# Altium schematic sheet Control Board.SchDoc
size 431 x 279 mm; SheetNumber: 1; SheetTotal: 2; SPICEModelCacheDHLYHQXB: <root> / <DocumentId>DHLYHQXB</DocumentId> / <CacheFrame Number="0"> / <Model Name="cap" Kind="MDL"> / <Text>*Default semiconductor capacitor / .MODEL CAP C()</Text> / </Model> / </CacheFrame> / </root>
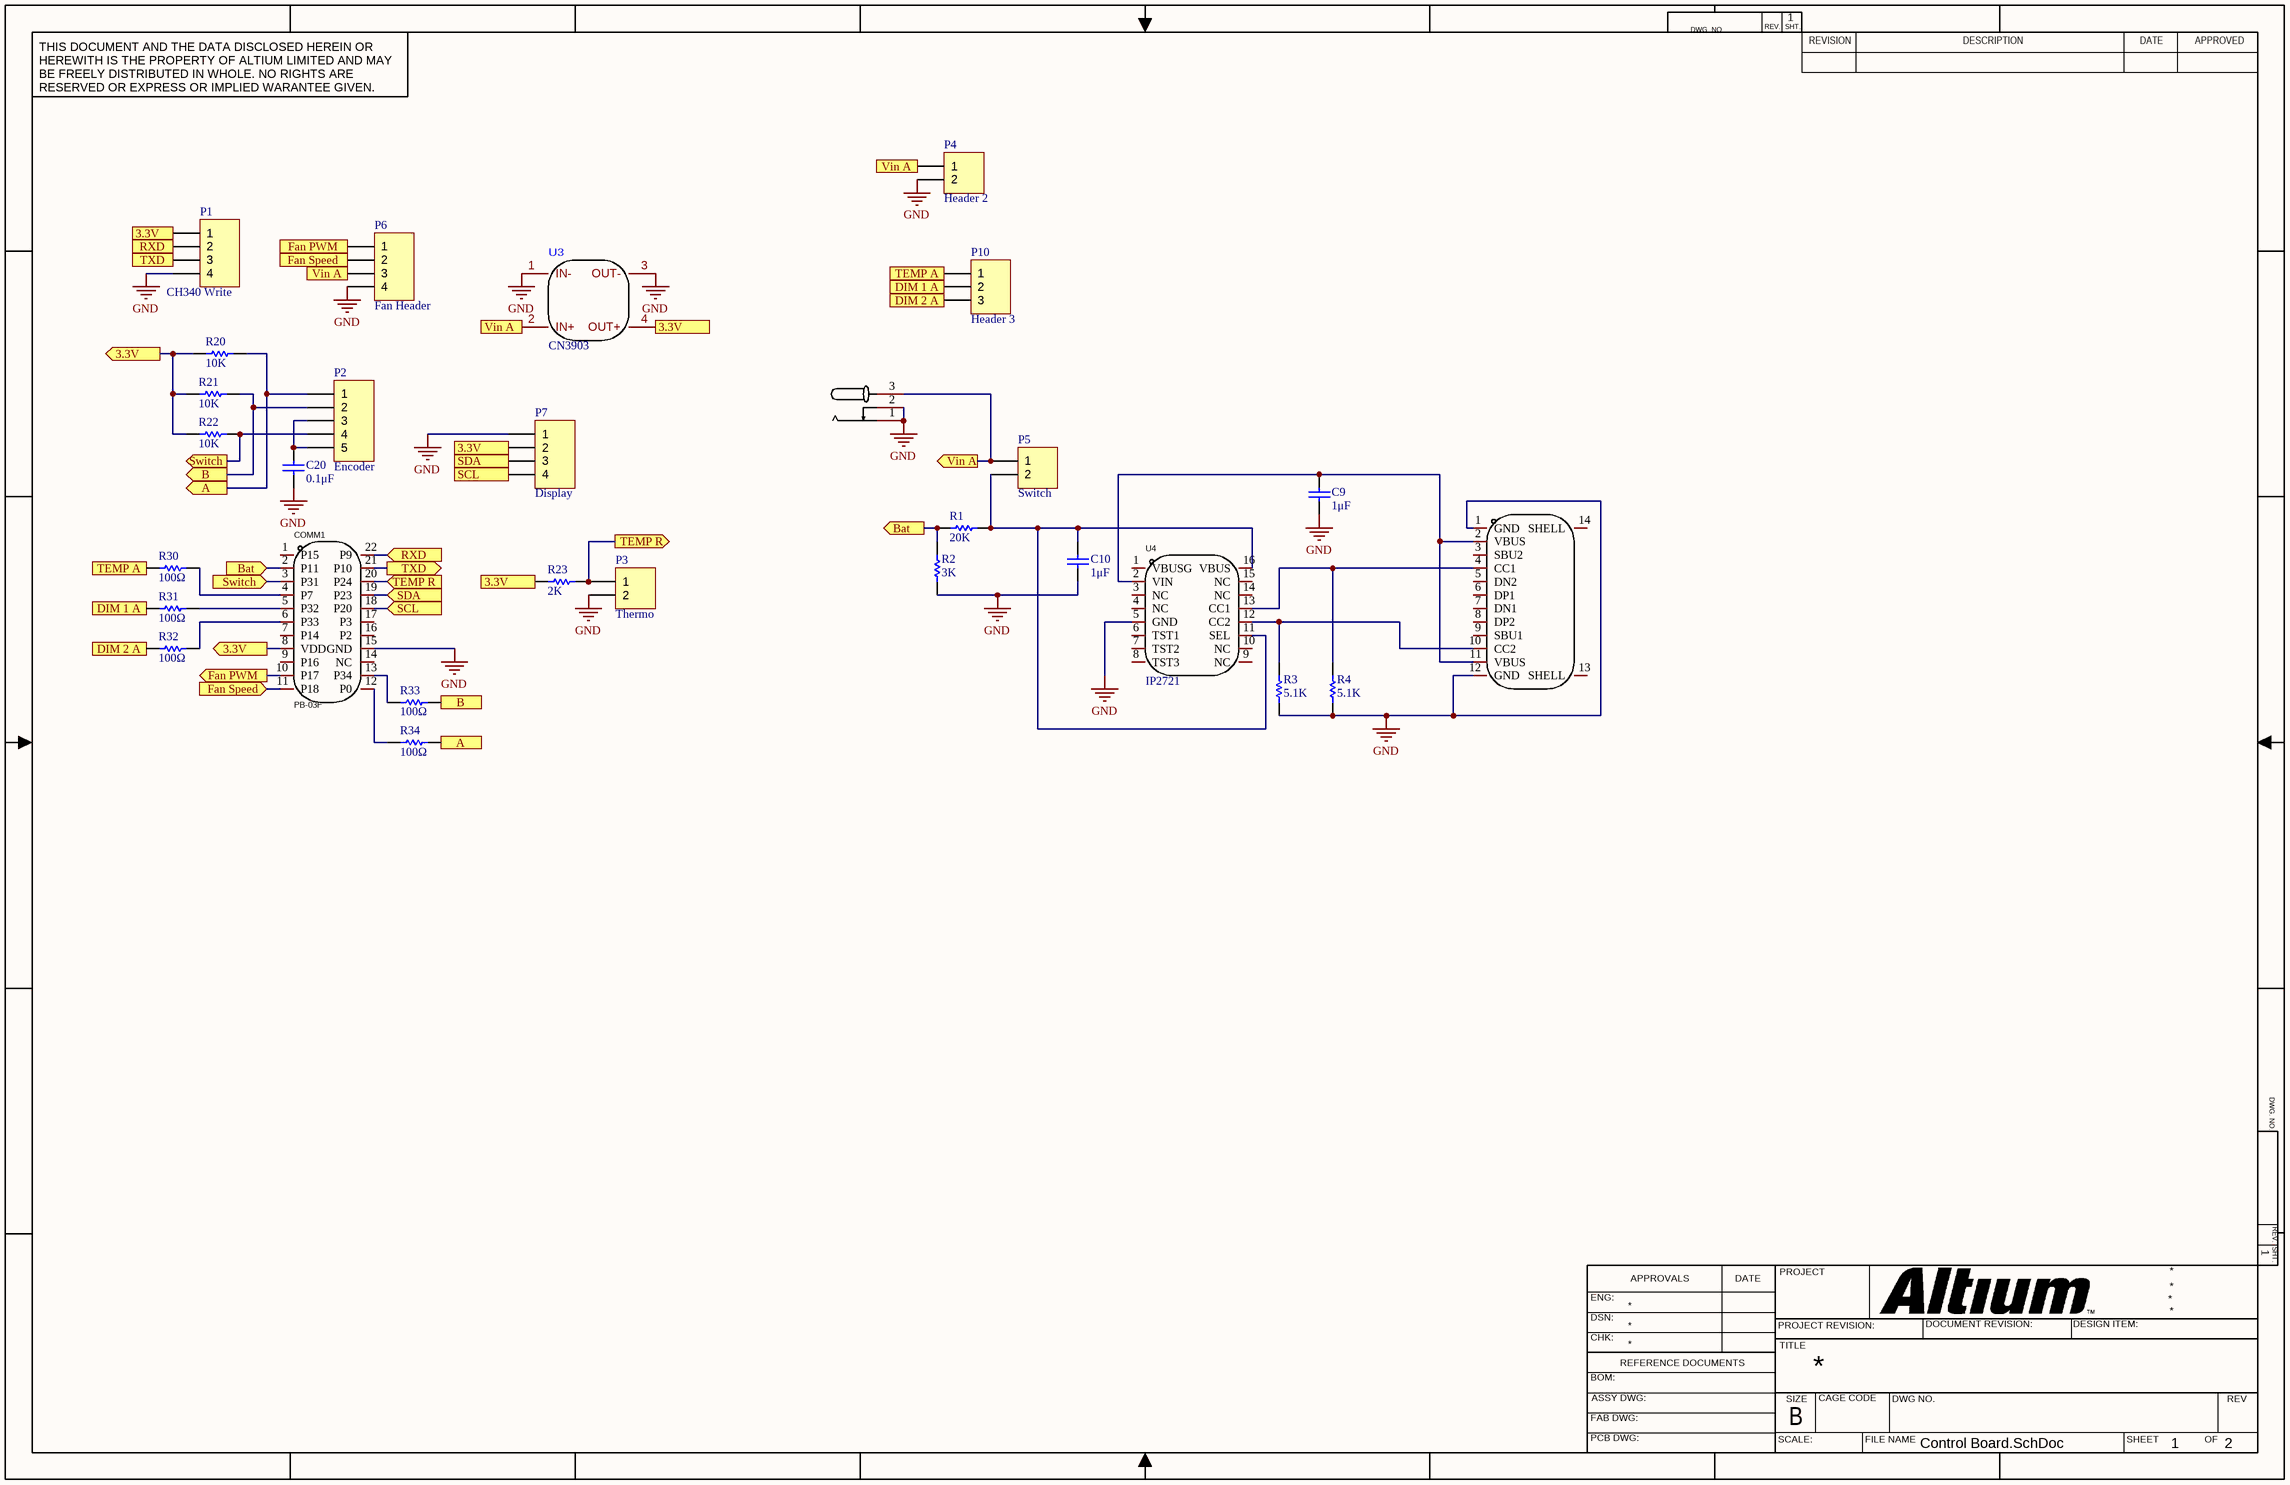
[diagram p0: Control Board.SchDoc]

## Parts
C9  value 1μF  [C0805]  (hidden comment: Cap)
C10  value 1μF  [C0805]  (hidden comment: Cap)
C20  value 0.1μF  [C0805]  (hidden comment: Cap)
COMM1  PB-03F  [BULETM-SMD_PB-03F]
DC1  DC-042C-Z-2.5-A  [DC-IN-TH_DC-042C-Z-2.5-A]  (value not drawn)
P1  CH340 Write  [HDR1X4]
P2  Encoder  [HDR1X5]
P3  Thermo  [HDR1X2]
P4  Header 2  [HDR1X2]
P5  Switch  [HDR1X2]
P6  Fan Header  [HDR1X4]
P7  Display  [HDR1X4]
P10  Header 3  [HDR1X3]
R1  value 20K  [C0805]  (hidden comment: Res1)
R2  value 3K  [C0805]  (hidden comment: Res1)
R3  value 5.1K  [C0805]  (hidden comment: Res1)
R4  value 5.1K  [C0805]  (hidden comment: Res1)
R20  value 10K  [C0805]  (hidden comment: Res1)
R21  value 10K  [C0805]  (hidden comment: Res1)
R22  value 10K  [C0805]  (hidden comment: Res1)
R23  value 2K  [C0805]  (hidden comment: Res1)
R30  value 100Ω  [C0805]  (hidden comment: Res1)
R31  value 100Ω  [C0805]  (hidden comment: Res1)
R32  value 100Ω  [C0805]  (hidden comment: Res1)
R33  value 100Ω  [C0805]  (hidden comment: Res1)
R34  value 100Ω  [C0805]  (hidden comment: Res1)
U3  Device: CN3903  [PCBComponent_1 - duplicate]
U4  IP2721  [TSSOP-16_L5.0-W4.4-P0.65-LS6.4-BL]
USB1  TYPE-C 16PIN 2MD(073)  [USB-C-SMD_TYPE-C-6PIN-2MD-073]  (value not drawn)

## Ports
3.3V (out), A (in), A (out), B (in), B (out), Bat (in), Bat (out), DIM 1 A (in), DIM 1 A (out), DIM 2 A (in), DIM 2 A (out), Fan PWM (in), Fan PWM (out), Fan Speed (in), Fan Speed (out), RXD (in), RXD (out), SCL (in), SCL (out), SDA (in), SDA (out), Switch (in), Switch (out), TEMP A (in), TEMP A (out), TEMP R (in), TEMP R (out), TXD (in), TXD (out), Vin A (in), Vin A (out)

## Nets
GND: C9.2 C10.2 C20.1 COMM1.15(GND) DC1.1 DC1.2 P1.4 P3.2 P4.2 P6.4 P7.1 R2.1 R3.2 R4.2 U3.1(IN-) U3.3(OUT-) U4.5(GND) USB1.1(GND) USB1.12(GND)
3.3V: COMM1.8(VDD) P1.1 P7.2 R20.1 R21.1 R22.1 R23.2 U3.4(OUT+) ; port 3.3V
A: P2.1 R20.2 R34.2 ; port A
B: P2.2 R21.2 R33.2 ; port B
Bat: COMM1.2(P11) R1.1 R2.2 ; port Bat
DIM 1 A: P10.2 R31.1 ; port DIM 1 A
DIM 2 A: P10.3 R32.1 ; port DIM 2 A
Fan PWM: COMM1.10(P17) P6.1 ; port Fan PWM
Fan Speed: COMM1.11(P18) P6.2 ; port Fan Speed
RXD: COMM1.22(P9) P1.2 ; port RXD
SCL: COMM1.18(P20) P7.4 ; port SCL
SDA: COMM1.19(P23) P7.3 ; port SDA
Switch: COMM1.3(P31) P2.4 R22.2 ; port Switch
TEMP A: P10.1 R30.1 ; port TEMP A
TEMP R: COMM1.20(P24) P3.1 R23.1 ; port TEMP R
TXD: COMM1.21(P10) P1.3 ; port TXD
Vin A: DC1.3 P4.1 P5.1 P6.3 U3.2(IN+) ; port Vin A
NetC9_1: C9.1 U4.2(VIN) USB1.2(VBUS) USB1.11(VBUS)
NetC10_1: C10.1 P5.2 R1.2 U4.11(SEL) U4.16(VBUS)
NetC20_2: C20.2 P2.3 P2.5
NetCOMM1_4: COMM1.4(P7) R30.2
NetCOMM1_5: COMM1.5(P32) R31.2
NetCOMM1_6: COMM1.6(P33) R32.2
NetCOMM1_12: COMM1.12(P0) R34.1
NetCOMM1_13: COMM1.13(P34) R33.1
NetR3_1: R3.1 U4.12(CC2) USB1.10(CC2)
NetR4_1: R4.1 U4.13(CC1) USB1.4(CC1)

Not connected (* = marked no-connect by the designer): COMM1 1(P15) 7(P14) 9(P16) 14(NC) 16(P2) 17(P3); U4 1(VBUSG) 3(NC) 4(NC) 6(TST1) 7(TST2) 8(TST3) 9(NC) 10(NC) 14(NC) 15(NC); USB1 3(SBU2) 5(DN2) 6(DP1) 7(DN1) 8(DP2) 9(SBU1) 13(SHELL) 14(SHELL)

## Notes on the sheet
- DWG. NO.
- REV.
- SHT.
- THIS DOCUMENT AND THE DATA DISCLOSED HEREIN OR HEREWITH IS THE PROPERTY OF ALTIUM LIMITED AND MAY BE FREELY DISTRIBUTED IN WHOLE. NO RIGHTS ARE RESERVED OR EXPRESS OR IMPLIED WARANTEE GIVEN.
- REVISION
- DESCRIPTION
- DATE
- APPROVED
- ENG:
- APPROVALS
- PROJECT
- DSN:
- CHK:
- REFERENCE DOCUMENTS
- PROJECT REVISION:
- TITLE
- DOCUMENT REVISION:
- DESIGN ITEM:
- BOM:
- FAB DWG:
- PCB DWG:
- ASSY DWG:
- SCALE:
- SIZE
- B
- CAGE CODE
- FILE NAME
- DWG NO.
- SHEET
- OF
- REV

## Library data of the parts
C9 C10 C20 = Cap: Capacitor; Published: 8-Jun-2000; LatestRevisionDate: 17-Jul-2002; LatestRevisionNote: Re-released for DXP Platform.; PackageReference: RAD-0.3; Publisher: Altium Limited; PackageDescription: Radial Cap, Thru-Hole; 2 Leads; 0.3 in Pin Spacing
COMM1 = PB-03F: Manufacturer: Ai-Thinker(安信可); Add into BOM: yes; Symbol: PB-03F; Device: PB-03F; Supplier: LCSC; Supplier Part: c; Manufacturer Part: PB-03F; JLCPCB Part Class: Extended Part; LCSC Part Name: PB-03F; Supplier Footprint: SMD,16x24mm; Datasheet: https://atta.szlcsc.com/upload/public/pdf/source/20220707/D814A4298A3D5539355587756A11D322.pdf; Convert to PCB: yes
DC1 = DC-042C-Z-2.5-A: Manufacturer: XKB Connectivity(中国星坤); Add into BOM: yes; Connector Type: DC电源插座; Inside Contact Diameter: 2.5mm; Outside Contact Diameter: 6mm; Current Rating (Max): 10A; Voltage Rating (Max): 20V; Soldering Temperature(Max): 260℃; Symbol: DC-042C-Z-2.5-A; Device: DC-042C-Z-2.5-A; LCSC Part Name: DC电源插座 内径:2.5mm 外径:6mm 不带开关; Supplier Part: C706901; Manufacturer Part: DC-042C-Z-2.5-A; Supplier Footprint: 插件; JLCPCB Part Class: Extended Part; Datasheet: https://atta.szlcsc.com/upload/public/pdf/source/20211011/A75ED48B9CCFCCBC07979616CD543B30.pdf; Supplier: LCSC; Convert to PCB: yes; Mounting Style: 弯插; Contact Material: 黄铜; Operating Temperature Range: -20℃~+70℃
P1 P6 P7 = Header 4: Header, 4-Pin; LatestRevisionDate: 17-Jul-2002; LatestRevisionNote: Re-released for DXP Platform.; Publisher: Altium Limited
P2 = Header 5: Header, 5-Pin; LatestRevisionDate: 17-Jul-2002; LatestRevisionNote: Re-released for DXP Platform.; Publisher: Altium Limited
P3-P5 = Header 2: Header, 2-Pin; LatestRevisionDate: 17-Jul-2002; LatestRevisionNote: Re-released for DXP Platform.; Publisher: Altium Limited
P10 = Header 3: Header, 3-Pin; LatestRevisionDate: 17-Jul-2002; LatestRevisionNote: Re-released for DXP Platform.; Publisher: Altium Limited
R1-R4 R20-R23 R30-R34 = Res1: Resistor; Published: 8-Jun-2000; LatestRevisionDate: 17-Jul-2002; LatestRevisionNote: Re-released for DXP Platform.; PackageReference: AXIAL-0.3; Publisher: Altium Limited; PackageDescription: Axial Device, Thru-Hole; 2 Leads; 0.3 in Pin Spacing
U3 = CN3903模块
U4 = IP2721: Manufacturer: INJOINIC(英集芯); Add into BOM: yes; Symbol: IP2721; Device: IP2721; LCSC Part Name: IP2721; Supplier Part: C603176; Manufacturer Part: IP2721; Supplier Footprint: TSSOP-16; JLCPCB Part Class: Extended Part; Datasheet: https://atta.szlcsc.com/upload/public/pdf/source/20200610/C603176_729C2C55A9E6451BDA9FCB913350E23E.pdf; Supplier: LCSC; Convert to PCB: yes
USB1 = TYPE-C 16PIN 2MD(073): Manufacturer: SHOU HAN(首韩); Add into BOM: yes; Gender: 母; Number of Ports: 1; Number of Contacts: 16P; Current Rating - Power (Max): 5A; Symbol: TYPE-C 16PIN 2MD(073); Device: TYPE-C 16PIN 2MD(073); Supplier: LCSC; Supplier Part: C2765186; Manufacturer Part: TYPE-C 16PIN 2MD(073); JLCPCB Part Class: Extended Part; LCSC Part Name: Type-C 母 卧贴; Supplier Footprint: SMD; Datasheet: https://atta.szlcsc.com/upload/public/pdf/source/20211123/39B17C16241EAC15C5E277BDA434118E.pdf; Convert to PCB: yes; Connector Type: Type-C; Standard: -; Mounting Style: 卧贴; Operating Temperature Range: -25℃~+85℃